# EAGLE design KeyboardRemapper (EAGLE 7.2.0)
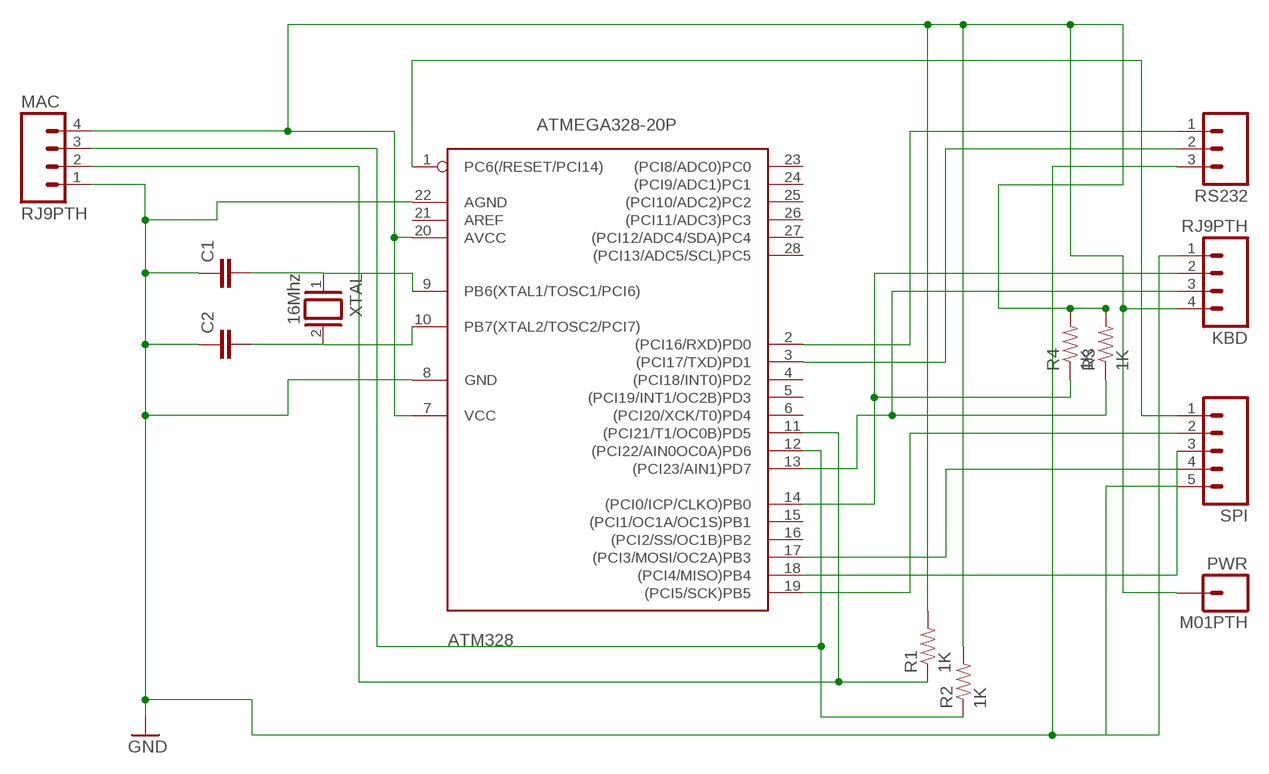
[diagram p0: schematic, sheet 1]

## Parts
ATM328  ATMEGA328-20P  [DIL28-3]
C1  CAPPTH2  [CAP-PTH-SMALL2]
C2  CAPPTH2  [CAP-PTH-SMALL2]
KBD  RJ9PTH  [RJ9]
MAC  RJ9PTH  [RJ9]
PWR  M01PTH  [1X01]
R1  1K  RESISTORPTH1  [AXIAL-0.3]
R2  1K  RESISTORPTH1  [AXIAL-0.3]
R3  1K  RESISTORPTH1  [AXIAL-0.3]
R4  1K  RESISTORPTH1  [AXIAL-0.3]
RS232  M03PTH  [1X03]
SPI  M05PTH  [1X05]
XTAL  16Mhz  XTAL/S  [QS]

## Nets
GND: ATM328.8(GND) ATM328.22(AGND) C1.1 C2.1 KBD.1 MAC.1 RS232.3 SPI.5
KBD_CLK: ATM328.14((PCI0/ICP/CLKO)PB0) KBD.2 R4.P$1
KBD_DATA: ATM328.13((PCI23/AIN1)PD7) KBD.3 R3.P$1
MAC_CLK: ATM328.11((PCI21/T1/OC0B)PD5) MAC.2 R1.P$1
MAC_DATA: ATM328.12((PCI22/AIN0OC0A)PD6) MAC.3 R2.P$1
MISO: ATM328.18((PCI4/MISO)PB4) SPI.3
MOSI: ATM328.17((PCI3/MOSI/OC2A)PB3) SPI.4
N$1: ATM328.10(PB7(XTAL2/TOSC2/PCI7)) C2.2 XTAL.2
N$2: ATM328.9(PB6(XTAL1/TOSC1/PCI6)) C1.2 XTAL.1
N$3: ATM328.2((PCI16/RXD)PD0) RS232.1
N$4: ATM328.3((PCI17/TXD)PD1) RS232.2
PWR: ATM328.7(VCC) ATM328.20(AVCC) KBD.4 MAC.4 PWR.1 R1.P$2 R2.P$2 R3.P$2 R4.P$2
RST: ATM328.1(PC6(/RESET/PCI14)) SPI.1
SCK: ATM328.19((PCI5/SCK)PB5) SPI.2
Unconnected: ATM328.4((PCI18/INT0)PD2) ATM328.5((PCI19/INT1/OC2B)PD3) ATM328.6((PCI20/XCK/T0)PD4) ATM328.15((PCI1/OC1A/OC1S)PB1) ATM328.16((PCI2/SS/OC1B)PB2) ATM328.21(AREF) ATM328.23((PCI8/ADC0)PC0) ATM328.24((PCI9/ADC1)PC1) ATM328.25((PCI10/ADC2)PC2) ATM328.26((PCI11/ADC3)PC3) ATM328.27((PCI12/ADC4/SDA)PC4) ATM328.28((PCI13/ADC5/SCL)PC5)

## Library data of the parts
ATM328 = atmega328:ATMEGA328*P: MICROCONTROLLER 32 kBytes FLASH 2 kBytes SRAM 1 kBytes EEPROM USART 8-channel 10 bit ADC
C1 C2 = SparkFun:CAP: Capacitor Standard 0603 ceramic capacitor, and 0.1" leaded capacitor.
KBD MAC = SparkFun:RJ9
PWR = SparkFun:M01: Header 1 Standard 1-pin 0.1" header. Use with straight break away headers (SKU : PRT-00116), right angle break away headers (PRT-00553), swiss pins (PRT-00743), machine pins (PRT-00117), and female headers (PRT-00115).
R1-R4 = SparkFun:RESISTOR: Resistor Basic schematic elements and footprints for 0603, 1206, and PTH 1/10th watt (small) resistors.
RS232 = SparkFun:M03: Header 3 Standard 3-pin 0.1" header. Use with straight break away headers (SKU : PRT-00116), right angle break away headers (PRT-00553), swiss pins (PRT-00743), machine pins (PRT-00117), and female headers (PRT-00115). Molex polarized connector foot print use with SKU : PRT-08232 with associated crimp pins and housings.
SPI = SparkFun:M05: Header 5 Standard 5-pin 0.1" header. Use with straight break away headers (SKU : PRT-00116), right angle break away headers (PRT-00553), swiss pins (PRT-00743), machine pins (PRT-00117), and female headers (PRT-00115). Molex polarized connector foot print use with SKU : PRT-08230 with associated crimp pins and housings.
XTAL = special:XTAL/S: CRYSTAL

## Board
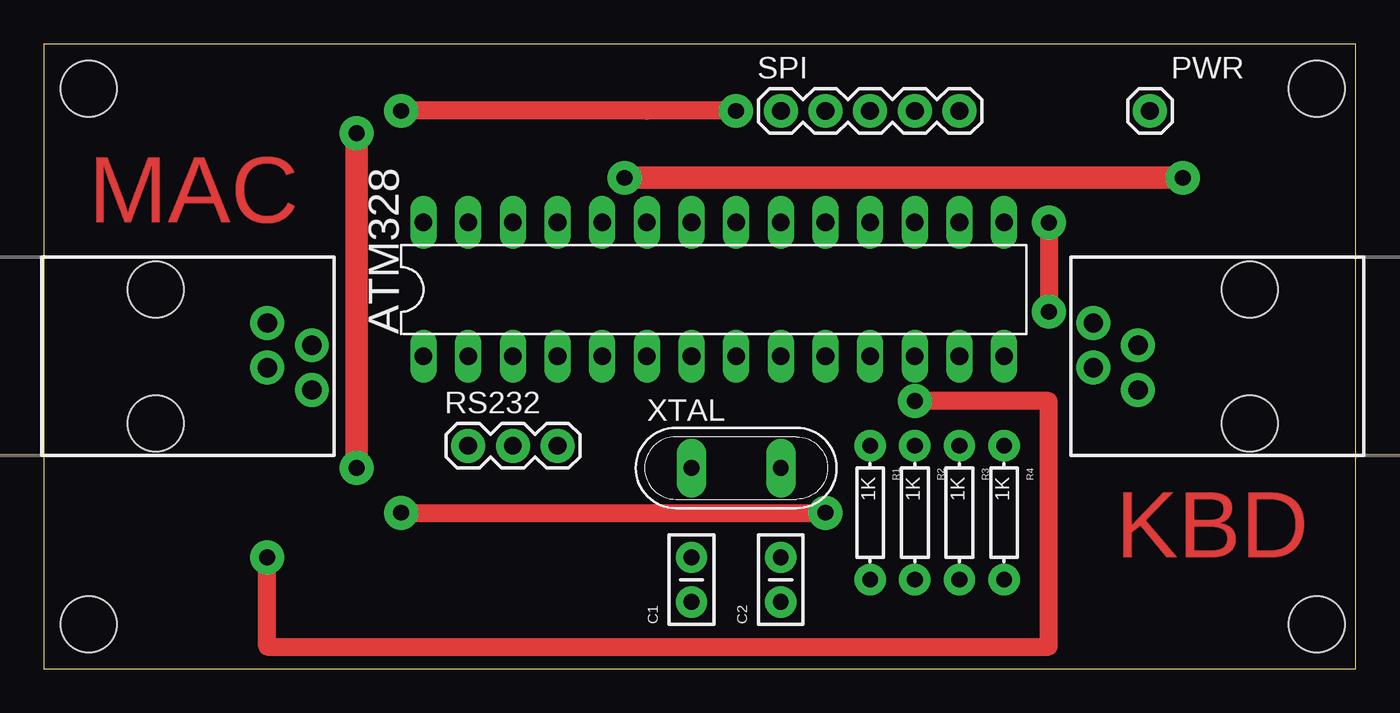
[diagram p1: board, top side]
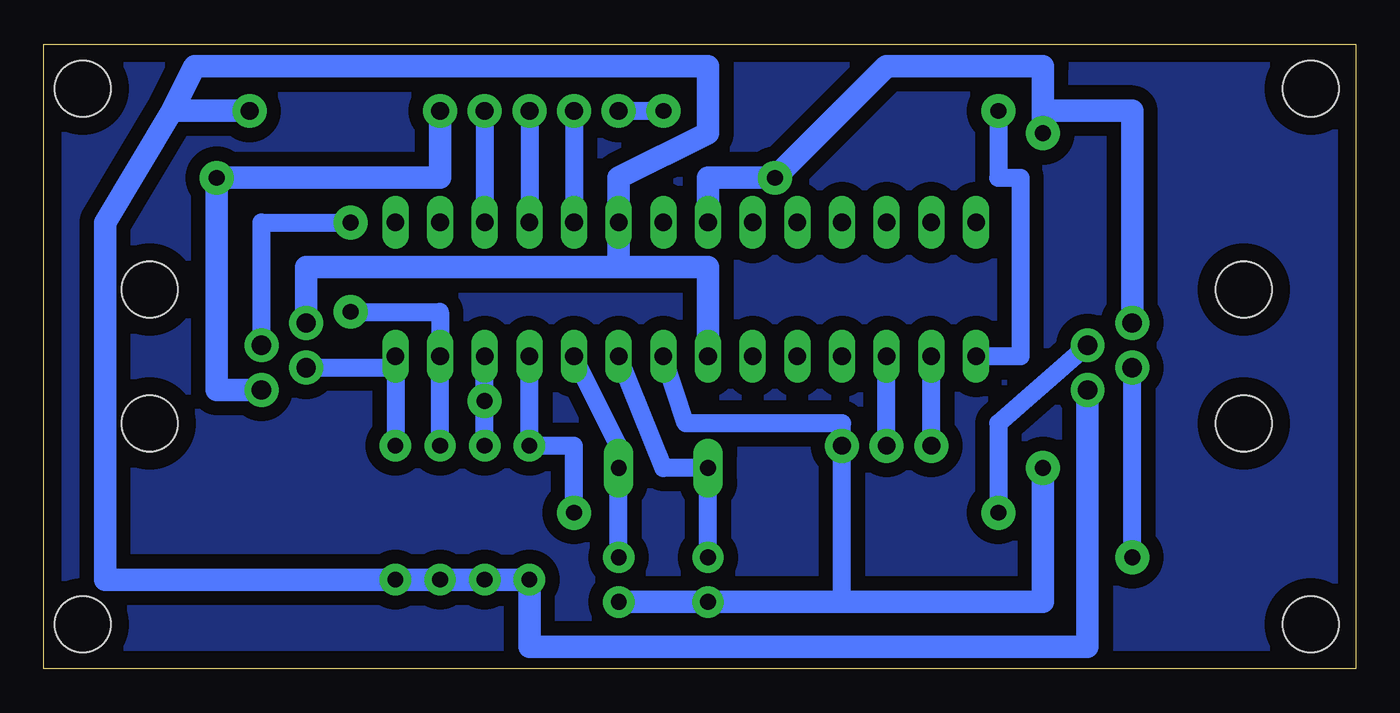
[diagram p2: board, bottom side, seen from below]

Size 74.6 x 35.55 mm. Coordinates in mm from the lower left corner, seen from the top.
Outline: 0,0 74.6,0 74.6,35.55 0,35.55 0,0
Copper layers (1*16): Top 0.035mm / dielectric 1.5mm / Bottom 0.035mm
Design rules "default": minimum track width 10mil, minimum drill 24mil, track to track 8mil, track to pad 8mil, pad to pad 8mil, via to via 8mil, smd to smd 8mil, copper to edge 40mil, drill to drill 8mil, minimum pad ring 10mil, minimum via ring 8mil, stop-mask expansion 4mil, vias tented up to drill 0mil, thermal gap 10mil
Holes 3.2 mm at 2.54,33.02 2.54,2.54 72.39,2.54 72.39,33.02

### Footprints (pad centres in the part's own frame; a part is rotated, then mirrored left to right if it is on the bottom)
DIL28-3 = drill 1 long: 1 -16.51,-3.81; 2 -13.97,-3.81; 3 -11.43,-3.81; 4 -8.89,-3.81; 5 -6.35,-3.81; 6 -3.81,-3.81; 7 -1.27,-3.81; 8 1.27,-3.81; 9 3.81,-3.81; 10 6.35,-3.81; 11 8.89,-3.81; 12 11.43,-3.81; 13 13.97,-3.81; 14 16.51,-3.81; 15 16.51,3.81; 16 13.97,3.81; 17 11.43,3.81; 18 8.89,3.81; 19 6.35,3.81; 20 3.81,3.81; 21 1.27,3.81; 22 -1.27,3.81; 23 -3.81,3.81; 24 -6.35,3.81; 25 -8.89,3.81; 26 -11.43,3.81; 27 -13.97,3.81; 28 -16.51,3.81
CAP-PTH-SMALL2 = drill 0.9 pad 1.778: 1 0,0; 2 2.54,0
RJ9 = drill 1.1 pad 1.93: 1 -1.905,6.35; 2 -0.635,8.89; 3 0.635,6.35; 4 1.905,8.89 | hole 3.2: -3.81,0; 3.81,0
1X01 = drill 1.016 pad 1.93: 1 0,0
AXIAL-0.3 = drill 0.9 pad 1.778: P$1 -3.81,0; P$2 3.81,0
1X03 = drill 1.016 pad 1.93: 1 0,0; 2 2.54,0; 3 5.08,0
1X05 = drill 1.016 pad 1.93: 1 0,0; 2 2.54,0; 3 5.08,0; 4 7.62,0; 5 10.16,0
QS = drill 0.9 pad 1.676 long: 1 -2.54,0; 2 2.54,0

### Placement (x,y rotation side)
ATM328  38.1,21.59 0 top
C1  36.83,3.81 90 top
C2  41.91,3.81 90 top
KBD  68.58,17.78 90 top
MAC  6.35,17.78 270 top
PWR  62.91,31.75 0 top
R1  46.99,8.89 270 top
R2  49.53,8.89 270 top
R3  52.07,8.89 270 top
R4  54.61,8.89 270 top
RS232  24.13,12.7 0 top
SPI  41.91,31.75 0 top
XTAL  39.37,11.43 0 top

### Tracks (layer width: path | path; a pad name or v marks a point on that pad's centre or on a via)
GND  (via drill 0.6, 0.9 pad 1.93)
  Top 1.27: v64.77,27.94 v33.02,27.94 | v17.78,11.43 v17.78,30.48
  Bottom 1.016: 29.21,3.81 RS232.3 29.21,13.97 38.1,13.97 ATM328.8
  Bottom 1.27: v17.78,11.43 17.78,3.81 29.21,3.81 C1.1 C2.1 | ATM328.22 36.83,27.94 v33.02,27.94 26.67,34.29 17.78,34.29 17.78,31.75 | v17.78,30.48 17.78,31.75 | SPI.5 52.07,27.94 v64.77,27.94 64.77,15.88 KBD.1 | MAC.1 12.7,31.75 17.78,31.75
KBD_CLK
  Bottom 0.406: 54.61,17.15 ATM328.14
  Bottom 1.016: KBD.2 54.61,17.15 | ATM328.14 R4.P$1
KBD_DATA  (via drill 0.9 pad 1.93)
  Top 1.016: v57.15,25.4 v57.15,20.32
  Bottom 1.016: KBD.3 62.23,25.4 v57.15,25.4 | v57.15,20.32 52.07,20.32 ATM328.13 R3.P$1
MAC_CLK  (via drill 0.9 pad 1.93)
  Top 1.016: v20.32,8.89 v44.45,8.89
  Bottom 1.016: ATM328.11 R1.P$1 44.45,12.7 v44.45,8.89 | MAC.2 20.32,13.97 v20.32,8.89
MAC_DATA  (via drill 0.9 pad 1.93)
  Top 1.016: v49.53,15.24 57.15,15.24 57.15,1.27 12.7,1.27 v12.7,6.35
  Bottom 1.016: R2.P$1 v49.53,15.24 ATM328.12 | v12.7,6.35 MAC.3
MISO
  Bottom 1.016: SPI.3 ATM328.18
MOSI
  Bottom 1.016: SPI.4 ATM328.17
N$1
  Bottom 1.016: C2.2 XTAL.2 41.91,12.7 ATM328.10
N$2
  Bottom 1.016: ATM328.9 39.37,11.43 XTAL.1 C1.2
N$3
  Bottom 1.016: RS232.1 ATM328.2
N$4
  Bottom 1.016: RS232.2 ATM328.3
N$6
  pour Bottom (isolate 0.813): 0,35.56 0,0 74.93,0 74.93,35.56
PWR
  Bottom 1.27: 41.91,22.86 ATM328.20 41.91,27.94 36.83,30.48 36.83,34.29 66.04,34.29 67.31,31.75 | 41.91,22.86 36.83,22.86 ATM328.7 | MAC.4 15.24,1.27 46.99,1.27 R1.P$2 R2.P$2 R4.P$2 R3.P$2 71.12,5.08 71.12,25.4 67.31,31.75 | KBD.4 59.69,22.86 41.91,22.86 | PWR.1 67.31,31.75
RST  (via drill 0.9 pad 1.93)
  Top 1.016: v39.37,31.75 34.29,31.75 v20.32,31.75
  Bottom 1.016: SPI.1 v39.37,31.75 | v20.32,31.75 20.32,27.94 19.05,27.94 19.05,17.78 ATM328.1
SCK
  Bottom 1.016: SPI.2 ATM328.19

### Text on the board
Top: MAC | KBD